# Altium schematic sheet 磁開關電路_20240913.SchDoc
size A3
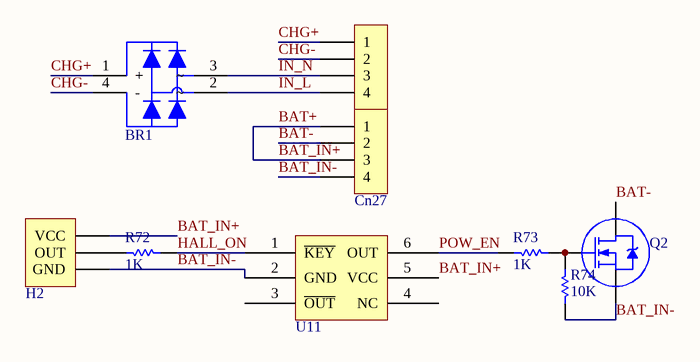
[diagram p0: 磁開關電路_20240913.SchDoc]

## Parts
BR1  KBL005  [BridgeRectifier_KBL005E451]  (value not drawn)
Cn22  KF2510-4  [Connector_KF2510-4W]  (value not drawn)
Cn27  KF2510-4  [Connector_KF2510-4W]  (value not drawn)
H2  A3212  [SOT 23-3]  (value not drawn)
Q2  TIP122  [TO-220 1>3>2]  (value not drawn)
R72  1K  [Res_1/4]
R73  1K  [Res_1/4]
R74  10K  [Res_1/4]
U11  CS2130  [SOT 23-6]  (value not drawn)

## Nets
BAT+: Cn27.1 Cn27.3 H2.1(VCC) U11.5(VCC)  [also labelled BAT_IN+]
BAT-: Cn27.2 Q2.3(D)
BAT_IN-: Cn27.4 H2.3(GND) Q2.2(S) R74.2 U11.2(GND)
CHG+: BR1.1(+) Cn22.1
CHG-: BR1.4(-) Cn22.2
HALL_ON: R72.1 U11.1(~{KEY})
IN_L: BR1.2 Cn22.4
IN_N: BR1.3 Cn22.3
POW_EN: R73.2 U11.6(OUT)
NetH2_2: H2.2(OUT) R72.2
NetQ2_1: Q2.1(G) R73.1 R74.1

Not connected (* = marked no-connect by the designer): U11 3(~{OUT}) 4(NC)

## Library data of the parts
BR1 = BridgeRectifier: 橋式整流; ComponentLink1Description: datasheet; ComponentLink1URL: http://www.zowie.com.tw/UserFiles/File/LX10M(2).pdf
Cn22 Cn27 = Contact(4P): 接線端子
H2 = Sensor_Hall: 感測器_霍爾
Q2 = MOS-N: 場效電晶體_N
R72-R74 = Res: 電阻
U11 = CS2130: 單鍵ON/OFF芯片; ComponentLink1Description: datasheet; ComponentLink1URL: http://www.szecm.com/Products/cs2130djkg.html